# EAGLE design version3 (EAGLE 9.6.2)
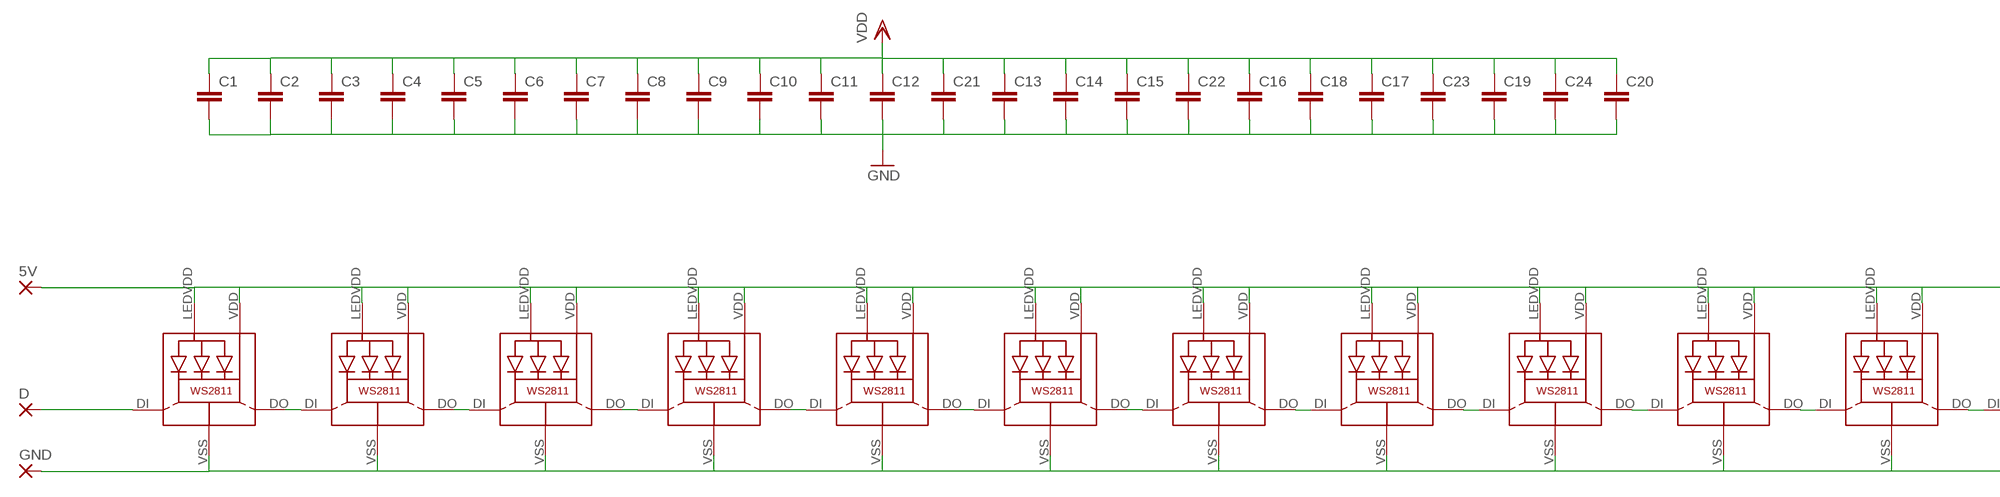
[diagram p0: schematic, sheet 1, part 1 of 2]
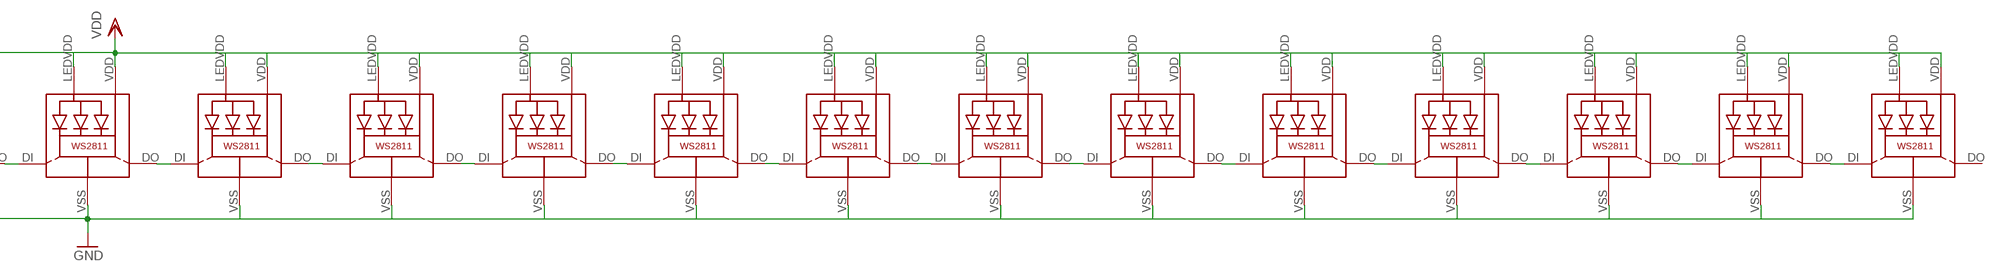
[diagram p1: schematic, sheet 1, part 2 of 2]

## Parts
5V  SMD5  [SMD2,54-5,08]
C1  C-EUC0603  [C0603]
C2  C-EUC0603  [C0603]
C3  C-EUC0603  [C0603]
C4  C-EUC0603  [C0603]
C5  C-EUC0603  [C0603]
C6  C-EUC0603  [C0603]
C7  C-EUC0603  [C0603]
C8  C-EUC0603  [C0603]
C9  C-EUC0603  [C0603]
C10  C-EUC0603  [C0603]
C11  C-EUC0603  [C0603]
C12  C-EUC0603  [C0603]
C13  C-EUC0603  [C0603]
C14  C-EUC0603  [C0603]
C15  C-EUC0603  [C0603]
C16  C-EUC0603  [C0603]
C17  C-EUC0603  [C0603]
C18  C-EUC0603  [C0603]
C19  C-EUC0603  [C0603]
C20  C-EUC0603  [C0603]
C21  C-EUC0603  [C0603]
C22  C-EUC0603  [C0603]
C23  C-EUC0603  [C0603]
C24  C-EUC0603  [C0603]
D  SMD5  [SMD2,54-5,08]
GND  SMD5  [SMD2,54-5,08]
LED1  WS28115050  [WS28115050]
LED2  WS28115050  [WS28115050]
LED3  WS28115050  [WS28115050]
LED4  WS28115050  [WS28115050]
LED5  WS28115050  [WS28115050]
LED6  WS28115050  [WS28115050]
LED7  WS28115050  [WS28115050]
LED8  WS28115050  [WS28115050]
LED9  WS28115050  [WS28115050]
LED10  WS28115050  [WS28115050]
LED11  WS28115050  [WS28115050]
LED12  WS28115050  [WS28115050]
LED13  WS28115050  [WS28115050]
LED14  WS28115050  [WS28115050]
LED15  WS28115050  [WS28115050]
LED16  WS28115050  [WS28115050]
LED17  WS28115050  [WS28115050]
LED18  WS28115050  [WS28115050]
LED19  WS28115050  [WS28115050]
LED20  WS28115050  [WS28115050]
LED21  WS28115050  [WS28115050]
LED22  WS28115050  [WS28115050]
LED23  WS28115050  [WS28115050]
LED24  WS28115050  [WS28115050]

## Nets
GND: C1.2 C2.2 C3.2 C4.2 C5.2 C6.2 C7.2 C8.2 C9.2 C10.2 C11.2 C12.2 C13.2 C14.2 C15.2 C16.2 C17.2 C18.2 C19.2 C20.2 C21.2 C22.2 C23.2 C24.2 GND.1(P) LED1.VSS(GND) LED2.VSS(GND) LED3.VSS(GND) LED4.VSS(GND) LED5.VSS(GND) LED6.VSS(GND) LED7.VSS(GND) LED8.VSS(GND) LED9.VSS(GND) LED10.VSS(GND) LED11.VSS(GND) LED12.VSS(GND) LED13.VSS(GND) LED14.VSS(GND) LED15.VSS(GND) LED16.VSS(GND) LED17.VSS(GND) LED18.VSS(GND) LED19.VSS(GND) LED20.VSS(GND) LED21.VSS(GND) LED22.VSS(GND) LED23.VSS(GND) LED24.VSS(GND)
N$1: LED1.DO LED2.DI
N$2: LED2.DO LED3.DI
N$3: LED3.DO LED4.DI
N$4: LED4.DO LED5.DI
N$5: LED5.DO LED6.DI
N$6: LED6.DO LED7.DI
N$7: LED7.DO LED8.DI
N$8: LED8.DO LED9.DI
N$9: LED9.DO LED10.DI
N$10: LED10.DO LED11.DI
N$11: LED11.DO LED12.DI
N$12: LED12.DO LED13.DI
N$13: LED13.DO LED14.DI
N$14: LED14.DO LED15.DI
N$15: LED15.DO LED16.DI
N$16: LED16.DO LED17.DI
N$17: LED17.DO LED18.DI
N$18: LED18.DO LED19.DI
N$19: LED19.DO LED20.DI
N$20: LED20.DO LED21.DI
N$21: LED21.DO LED22.DI
N$22: LED22.DO LED23.DI
N$23: LED23.DO LED24.DI
N$26: D.1(P) LED1.DI
VDD: 5V.1(P) C1.1 C2.1 C3.1 C4.1 C5.1 C6.1 C7.1 C8.1 C9.1 C10.1 C11.1 C12.1 C13.1 C14.1 C15.1 C16.1 C17.1 C18.1 C19.1 C20.1 C21.1 C22.1 C23.1 C24.1 LED1.LEDVDD LED1.VDD LED2.LEDVDD LED2.VDD LED3.LEDVDD LED3.VDD LED4.LEDVDD LED4.VDD LED5.LEDVDD LED5.VDD LED6.LEDVDD LED6.VDD LED7.LEDVDD LED7.VDD LED8.LEDVDD LED8.VDD LED9.LEDVDD LED9.VDD LED10.LEDVDD LED10.VDD LED11.LEDVDD LED11.VDD LED12.LEDVDD LED12.VDD LED13.LEDVDD LED13.VDD LED14.LEDVDD LED14.VDD LED15.LEDVDD LED15.VDD LED16.LEDVDD LED16.VDD LED17.LEDVDD LED17.VDD LED18.LEDVDD LED18.VDD LED19.LEDVDD LED19.VDD LED20.LEDVDD LED20.VDD LED21.LEDVDD LED21.VDD LED22.LEDVDD LED22.VDD LED23.LEDVDD LED23.VDD LED24.LEDVDD LED24.VDD
Unconnected: LED24.DO

## Library data of the parts
5V D GND = wirepad:SMD5: SMD PAD
C1-C24 = rcl:C-EU: CAPACITOR, European symbol
LED1-LED24 = microbuilder:WS28115050

## Board
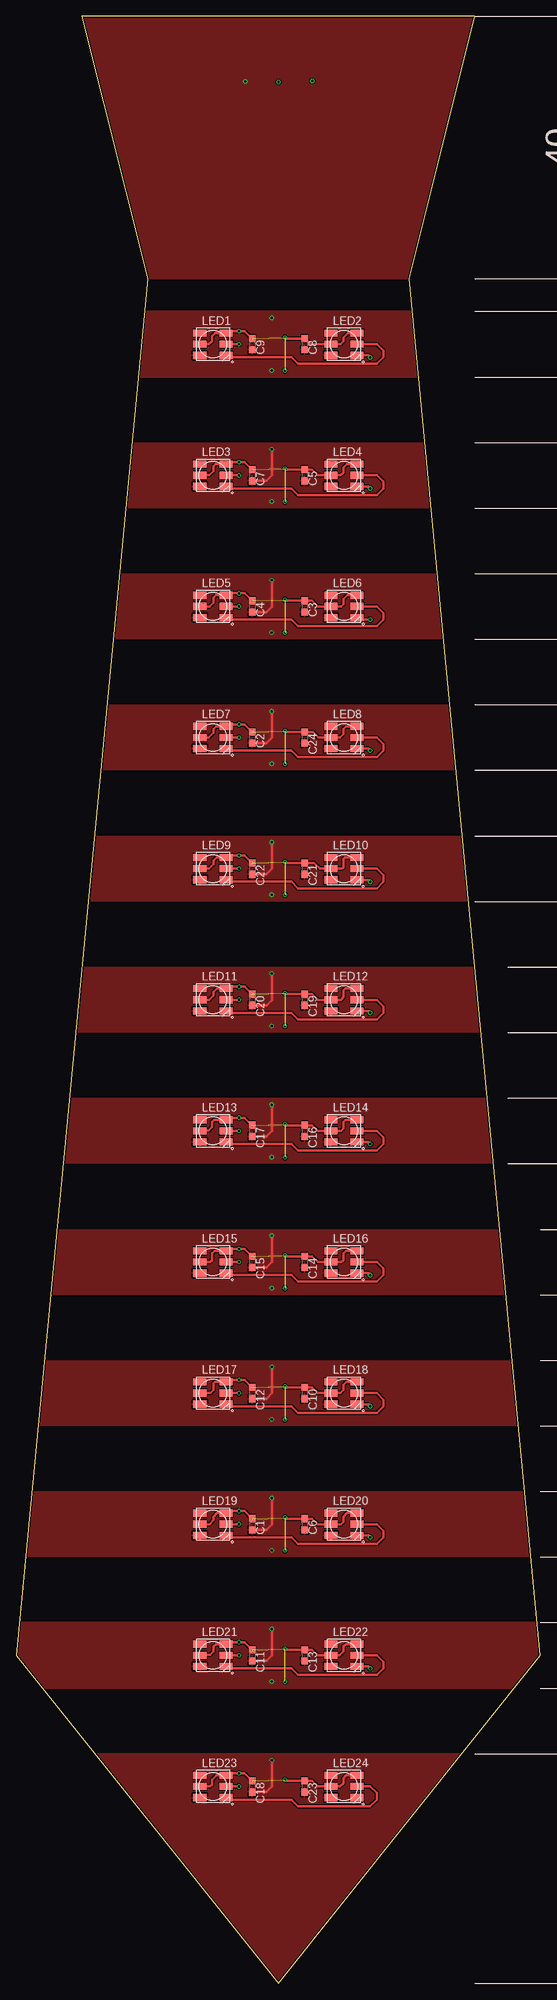
[diagram p2: board, top side]
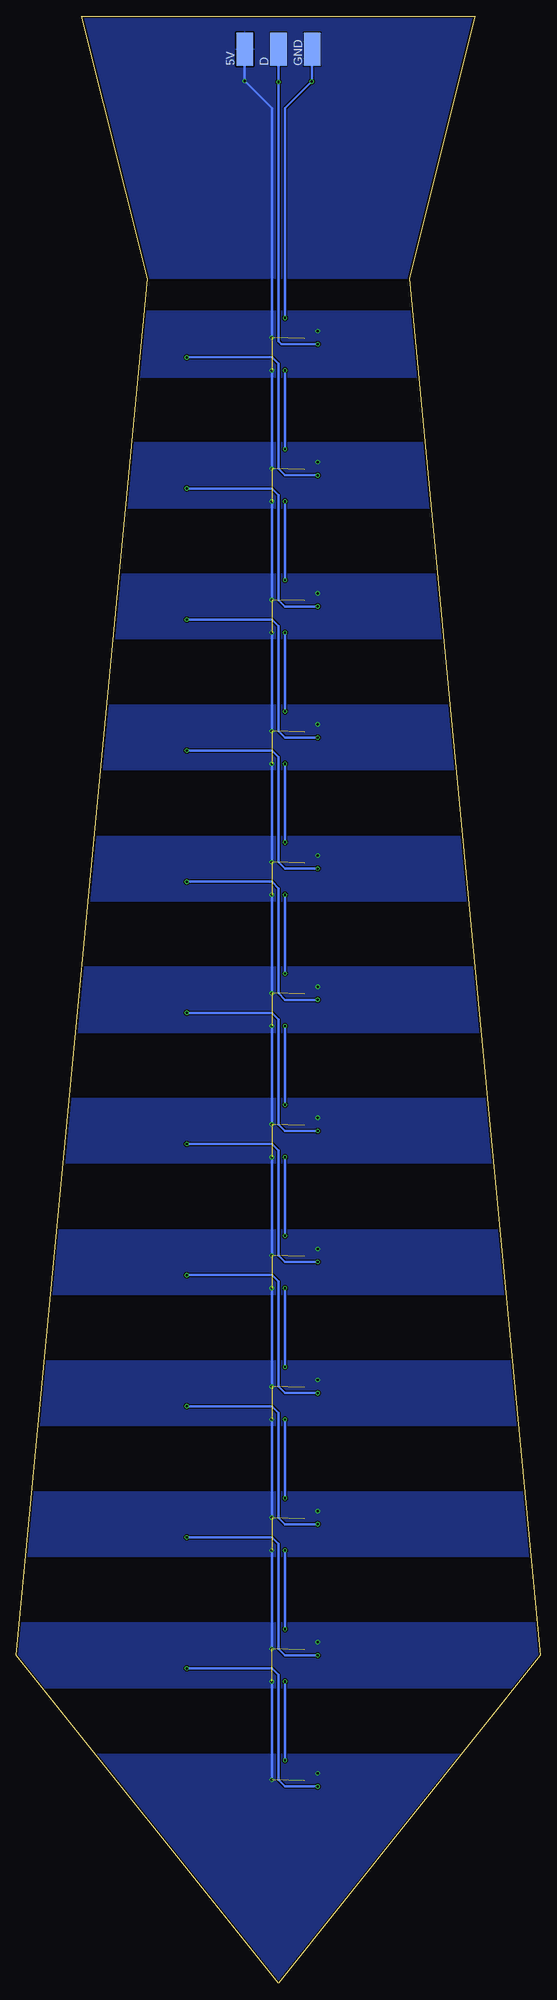
[diagram p3: board, bottom side, seen from below]

Size 80 x 300 mm. Coordinates in mm from the lower left corner, seen from the top.
Outline: 20,260 0,50 40,0 80,50 60,260 70,300 10,300 20,260
Copper layers (1*16): Top 0.035mm / dielectric 1.5mm / Bottom 0.035mm
Design rules "seeed-studio-2-layer": minimum track width 6mil, minimum drill 12mil, track to track 6mil, track to pad 6mil, pad to pad 6mil, via to via 6mil, smd to smd 0mil, copper to edge 10mil, drill to drill 10mil, minimum pad ring 10mil, minimum via ring 6mil, stop-mask expansion 2mil, vias tented up to drill 100mil, thermal gap 10mil

### Footprints (pad centres in the part's own frame; a part is rotated, then mirrored left to right if it is on the bottom)
SMD2,54-5,08 = smd 2.54 x 5.08: 1 0,0
C0603 = smd 1.1 x 1: 1 -0.85,0; 2 0.85,0
WS28115050 = smd 2 x 1.1: DI 2,0; DO 2,-1.7; LEDVDD -2,0; NC -2,1.7; VDD 2,1.7; VSS -2,-1.7

### Placement (x,y rotation side)
5V  45.16,295 0 bottom
C1  36,70 270 top
C2  36,190 270 top
C3  44,210 270 top
C4  36,210 270 top
C5  44,230 270 top
C6  44,70 270 top
C7  36,230 270 top
C8  44,250 270 top
C9  36,250 270 top
C10  44,90 270 top
C11  36,50 270 top
C12  36,90 270 top
C13  44,50 270 top
C14  44,110 270 top
C15  36,110 270 top
C16  44,130 270 top
C17  36,130 270 top
C18  36,30 270 top
C19  44,150 270 top
C20  36,150 270 top
C21  44,170 270 top
C22  36,170 270 top
C23  44,30 270 top
C24  44,190 270 top
D  40,295 0 bottom
GND  34.84,295 0 bottom
LED1  30,250 0 top
LED2  50,250 0 top
LED3  30,230 0 top
LED4  50,230 0 top
LED5  30,210 0 top
LED6  50,210 0 top
LED7  30,190 0 top
LED8  50,190 0 top
LED9  30,170 0 top
LED10  50,170 0 top
LED11  30,150 0 top
LED12  50,150 0 top
LED13  30,130 0 top
LED14  50,130 0 top
LED15  30,110 0 top
LED16  50,110 0 top
LED17  30,90 0 top
LED18  50,90 0 top
LED19  30,70 0 top
LED20  50,70 0 top
LED21  30,50 0 top
LED22  50,50 0 top
LED23  30,30 0 top
LED24  50,30 0 top

### Tracks (layer width: path | path; a pad name or v marks a point on that pad's centre or on a via)
GND  (via drill 0.35)
  Top 0.406: C2.2 38.15,189.15 39,190 v39,194 | C4.2 38.15,209.15 39,210 v39,214 | C7.2 38.15,229.15 39,230 v39,234 | C22.2 38.15,169.15 39,170 v39,174 | C17.2 38.15,129.15 39,130 v39,134 | C15.2 38.15,109.15 39,110 v39,114 | C12.2 38.15,89.15 39,90 v39,94 | C1.2 38.15,69.15 39,70 v39,74 | C11.2 38.15,49.15 39,50 v39,54 | C18.2 38.15,29.15 39,30 v39,34 | C20.2 38.15,149.15 39,150 v39,154
  Bottom 0.406: v39,254 39,286 v34.92,290.08 34.92,295 GND.1 | v39,234 v39,246 | v39,214 v39,226 | v39,194 v39,206 | v39,174 v39,186 | v39,134 v39,146 | v39,114 v39,126 | v39,94 v39,106 | v39,74 v39,86 | v39,54 v39,66 | v39,34 v39,46 | v39,154 v39,166
  Bottom 0.61: GND.1 34.92,294.92
  pour Top: 10,300 10,260 70,260 70,300
  pour Top: 10,255 10,245 70,245 70,255
  pour Top: 10,235 70,235 70,225 10,225
  pour Top: 10,215 70,215 70,205 10,205
  pour Top: 10,195 70,195 70,185 10,185
  pour Top: 10,175 70,175 70,165 10,165
  pour Top: 5,155 75,155 75,145 5,145
  pour Top: 0,115 80,115 80,105 0,105
  pour Top: 5,135 75,135 75,125 5,125
  pour Top: 0,95 80,95 80,85 0,85
  pour Top: 0,75 80,75 80,65 0,65
  pour Top: 0,45 80,45 80,55 0,55
  pour Top: 10,35 10,0 70,0 70,35
N$1
  Top 0.406: LED1.DO 32.3,248 42,248 43,247 55,247 56,248 56,249 55,250 LED2.DI
N$2  (via drill 0.35)
  Top 0.406: LED2.DO 53.7,248.3 v54,248 | v34,230 LED3.DI
  Bottom 0.406: v54,248 41,248 40,247 40,231 39,230 v34,230
N$3
  Top 0.406: LED3.DO 32.3,228 42,228 43,227 55,227 56,228 56,229 55,230 LED4.DI
N$4  (via drill 0.35)
  Top 0.406: LED4.DO 53.7,228.3 v54,228 | LED5.DI v34,210
  Bottom 0.406: v54,228 41,228 40,227 40,211 39,210 v34,210
N$5
  Top 0.406: LED5.DO 32.3,208 42,208 43,207 55,207 56,208 56,209 55,210 LED6.DI
N$6  (via drill 0.35)
  Top 0.406: LED6.DO 52.3,208 v54,208 | v34,190 LED7.DI
  Bottom 0.406: v54,208 41,208 40,207 40,191 39,190 v34,190
N$7
  Top 0.406: LED7.DO 32.7,188.3 33,188 42,188 43,187 55,187 56,188 56,189 55,190 LED8.DI
N$8  (via drill 0.35)
  Top 0.406: LED8.DO 53.7,188.3 v54,188 | v34,170 LED9.DI
  Bottom 0.406: v54,188 41,188 40,187 40,171 39,170 v34,170
N$9
  Top 0.406: LED9.DO 32.7,168.3 33,168 42,168 43,167 55,167 56,168 56,169 55,170 LED10.DI
N$10  (via drill 0.35)
  Top 0.406: LED10.DO 53.7,168.3 v54,168 | v34,150 LED11.DI
  Bottom 0.406: v54,168 41,168 40,167 40,151 39,150 v34,150
N$11
  Top 0.406: LED11.DO 32.7,148.3 33,148 42,148 43,147 55,147 56,148 56,149 55,150 LED12.DI
N$12  (via drill 0.35)
  Top 0.406: LED12.DO 53.7,148.3 v54,148 | v34,130 LED13.DI
  Bottom 0.406: v54,148 41,148 40,147 40,131 39,130 v34,130
N$13
  Top 0.406: LED13.DO 32.7,128.3 33,128 42,128 43,127 55,127 56,128 56,129 55,130 LED14.DI
N$14  (via drill 0.35)
  Top 0.406: LED14.DO 53.7,128.3 v54,128 | v34,110 LED15.DI
  Bottom 0.406: v54,128 41,128 40,127 40,111 39,110 v34,110
N$15
  Top 0.406: LED15.DO 32.7,108.3 33,108 42,108 43,107 55,107 56,108 56,109 55,110 LED16.DI
N$16  (via drill 0.35)
  Top 0.406: LED16.DO 53.7,108.3 v54,108 | v34,90 LED17.DI
  Bottom 0.406: v54,108 41,108 40,107 40,91 39,90 v34,90
N$17
  Top 0.406: LED17.DO 32.7,88.3 33,88 42,88 43,87 55,87 56,88 56,89 55,90 LED18.DI
N$18  (via drill 0.35)
  Top 0.406: LED18.DO 53.7,88.3 v54,88 | v34,70 LED19.DI
  Bottom 0.406: v54,88 41,88 40,87 40,71 39,70 v34,70
N$19
  Top 0.406: LED19.DO 32.7,68.3 33,68 42,68 43,67 55,67 56,68 56,69 55,70 LED20.DI
N$20  (via drill 0.35)
  Top 0.406: LED20.DO 53.7,68.3 v54,68 | v34,50 LED21.DI
  Bottom 0.406: v54,68 41,68 40,67 40,51 39,50 v34,50
N$21
  Top 0.406: LED21.DO 32.7,48.3 33,48 42,48 43,47 55,47 56,48 56,49 55,50 LED22.DI
N$22  (via drill 0.35)
  Top 0.406: LED22.DO 53.7,48.3 v54,48 | v34,30 LED23.DI
  Bottom 0.406: v54,48 41,48 40,47 40,31 39,30 v34,30
N$23
  Top 0.406: LED23.DO 32.7,28.3 33,28 42,28 43,27 54,27 55,28 55,29 54,30 LED24.DI
N$26  (via drill 0.35)
  Top 0.406: v34,250 LED1.DI
  Bottom 0.406: v34,250 39.53,250 40,250.47 v40,290 | D.1 v40,290 | v40,290
VDD  (via drill 0.35)  (23 unrouted)
  Top 0.406: 52.3,252 LED2.VDD 50.63,251.7 49.91,250.98 49.91,250.47 49.44,250 LED2.LEDVDD 45,250 44.08,250.93 | C9.1 34.85,252 v34,252 32.3,252 LED1.VDD 30.31,251.7 29.84,251.23 29.84,250.47 29.37,250 LED1.LEDVDD | v41,251 41.15,250.85 C8.1 44.08,250.93 | v41,231 41.15,230.85 C5.1 45.15,230.85 46,230 LED4.LEDVDD 49.5,230 49.91,230.4 49.91,231.17 50.44,231.7 LED4.VDD | 44.15,251 44.08,250.93 | C7.1 34.85,232 v34,232 32.3,232 LED3.VDD 30.37,231.7 30.09,231.42 30.09,230.66 29.44,230 LED3.LEDVDD | v41,211 41.15,210.85 C3.1 45.15,210.85 46,210 LED6.LEDVDD 49.57,210 49.91,210.34 49.91,211.1 50.51,211.7 LED6.VDD | C4.1 34.85,212 v34,212 32.3,212 LED5.VDD 30.44,211.7 30.09,211.35 30.09,210.59 29.5,210 LED5.LEDVDD | v41,191 41.15,190.85 C24.1 45.26,190.85 46.11,190 LED8.LEDVDD 49.38,190 49.91,190.53 49.91,191.29 50.32,191.7 LED8.VDD | v41,171 41.15,170.85 C21.1 45.45,170.85 46.3,170 LED10.LEDVDD 49.7,170 49.91,170.21 49.91,171.48 50.13,171.7 LED10.VDD | v41,151 41.15,150.85 C19.1 45.15,150.85 46,150 LED12.LEDVDD 49.51,150 49.91,150.39 49.91,151.41 50.2,151.7 LED12.VDD | v41,131 41.15,130.85 C16.1 45.15,130.85 46,130 LED14.LEDVDD 49.58,130 49.91,130.33 49.91,131.34 50.26,131.7 LED14.VDD | v41,111 41.15,110.85 C14.1 45.15,110.85 46,110 LED16.LEDVDD 49.65,110.01 49.91,110.26 49.91,111.28 50.33,111.7 LED16.VDD | v41,91 41.15,90.85 C10.1 45.15,90.85 46,90 LED18.LEDVDD 49.46,90 49.91,90.45 49.91,91.21 50.39,91.7 LED18.VDD | v41,71 41.15,70.85 C6.1 45.15,70.85 46,70 LED20.LEDVDD 49.52,70 49.91,70.38 49.91,71.15 50.46,71.7 LED20.VDD | v41,51 41.15,50.85 C13.1 45.15,50.85 46,50 LED22.LEDVDD 49.33,50 49.91,50.57 49.91,51.33 50.27,51.7 LED22.VDD
  Top 0.406: v41,31 41.15,30.85 C23.1 45.15,30.85 46,30 LED24.LEDVDD | C17.1 34.85,132 v34,132 32.3,132 LED13.VDD 30.2,131.7 29.84,131.34 29.84,130.58 29.33,130.07 28.07,130.07 LED13.LEDVDD | C20.1 34.85,152 v34,152 32.3,152 LED11.VDD 30.64,151.7 30.09,151.16 30.09,150.65 29.45,150 LED11.LEDVDD | C18.1 34.85,32 v34,32 32.3,32 LED23.VDD 30.53,31.7 29.84,31.01 29.84,30.25 29.59,30 29.08,30 LED23.LEDVDD | C11.1 34.85,52 v34,52 32.3,52 LED21.VDD 30.46,51.7 30.09,51.33 30.09,50.57 29.59,50.06 28.06,50.06 LED21.LEDVDD | C1.1 34.85,72 v34,72 32.3,72 LED19.VDD 30.65,71.7 30.09,71.15 30.09,70.64 29.46,70 LED19.LEDVDD | C12.1 34.85,92 v34,92 32.3,92 LED17.VDD 30.33,91.7 30.09,91.47 30.09,90.45 29.64,90 LED17.LEDVDD | C15.1 34.85,112 v34,112 32.3,112 LED15.VDD 30.26,111.7 29.84,111.28 29.84,110.26 29.59,110.01 LED15.LEDVDD | C2.1 34.85,192 v34,192 32.3,192 LED7.VDD 30.51,191.7 30.09,191.29 30.09,190.78 29.31,190 LED7.LEDVDD | C22.1 34.85,172 v34,172 32.3,172 LED9.VDD 30.57,171.7 30.09,171.22 30.09,170.71 29.38,170 LED9.LEDVDD | 48.12,30.12 LED24.LEDVDD | 51.23,31.7 LED24.VDD 50.34,31.7 49.91,31.27 49.91,30.51 49.4,30 49.14,30 LED24.LEDVDD
  Bottom 0.406: 5V.1 v45.16,290.16 41,286 v41,251 | v41,231 v41,246 | v41,211 v41,226 | v41,191 v41,206 | v41,171 v41,186 | v41,151 v41,166 | v41,131 v41,146 | v41,111 v41,126 | v41,91 v41,106 | v41,71 v41,86 | v41,51 v41,66 | v41,31 v41,46
  pour Bottom: 10,235 70,235 70,225 10,225
  pour Bottom: 10,255 70,255 70,245 10,245
  pour Bottom: 10,260 70,260 70,300 10,300
  pour Bottom: 10,215 10,205 70,205 70,215
  pour Bottom: 10,195 10,185 70,185 70,195
  pour Bottom: 10,175 10,165 70,165 70,175
  pour Bottom: 5,155 75,155 75,145 5,145
  pour Bottom: 5,135 5,125 75,125 75,135
  pour Bottom: 0,115 0,105 80,105 80,115
  pour Bottom: 0,95 0,85 80,85 80,95
  pour Bottom: 0,75 0,65 80,65 80,75
  pour Bottom: 0,55 0,45 80,45 80,55
  pour Bottom: 10,35 10,0 70,0 70,35

### Text on the board
tPlace: Stiffener BOT | Stiffener BOT | Stiffener BOT | Stiffener BOT | Stiffener BOT | Stiffener BOT | Stiffener BOT | Stiffener BOT | Stiffener BOT | Stiffener BOT | Stiffener BOT | Stiffener BOT | Stiffener BOT